# EAGLE design SHIFT_REG_LED_CONTROLLER copy (EAGLE 9.6.2)
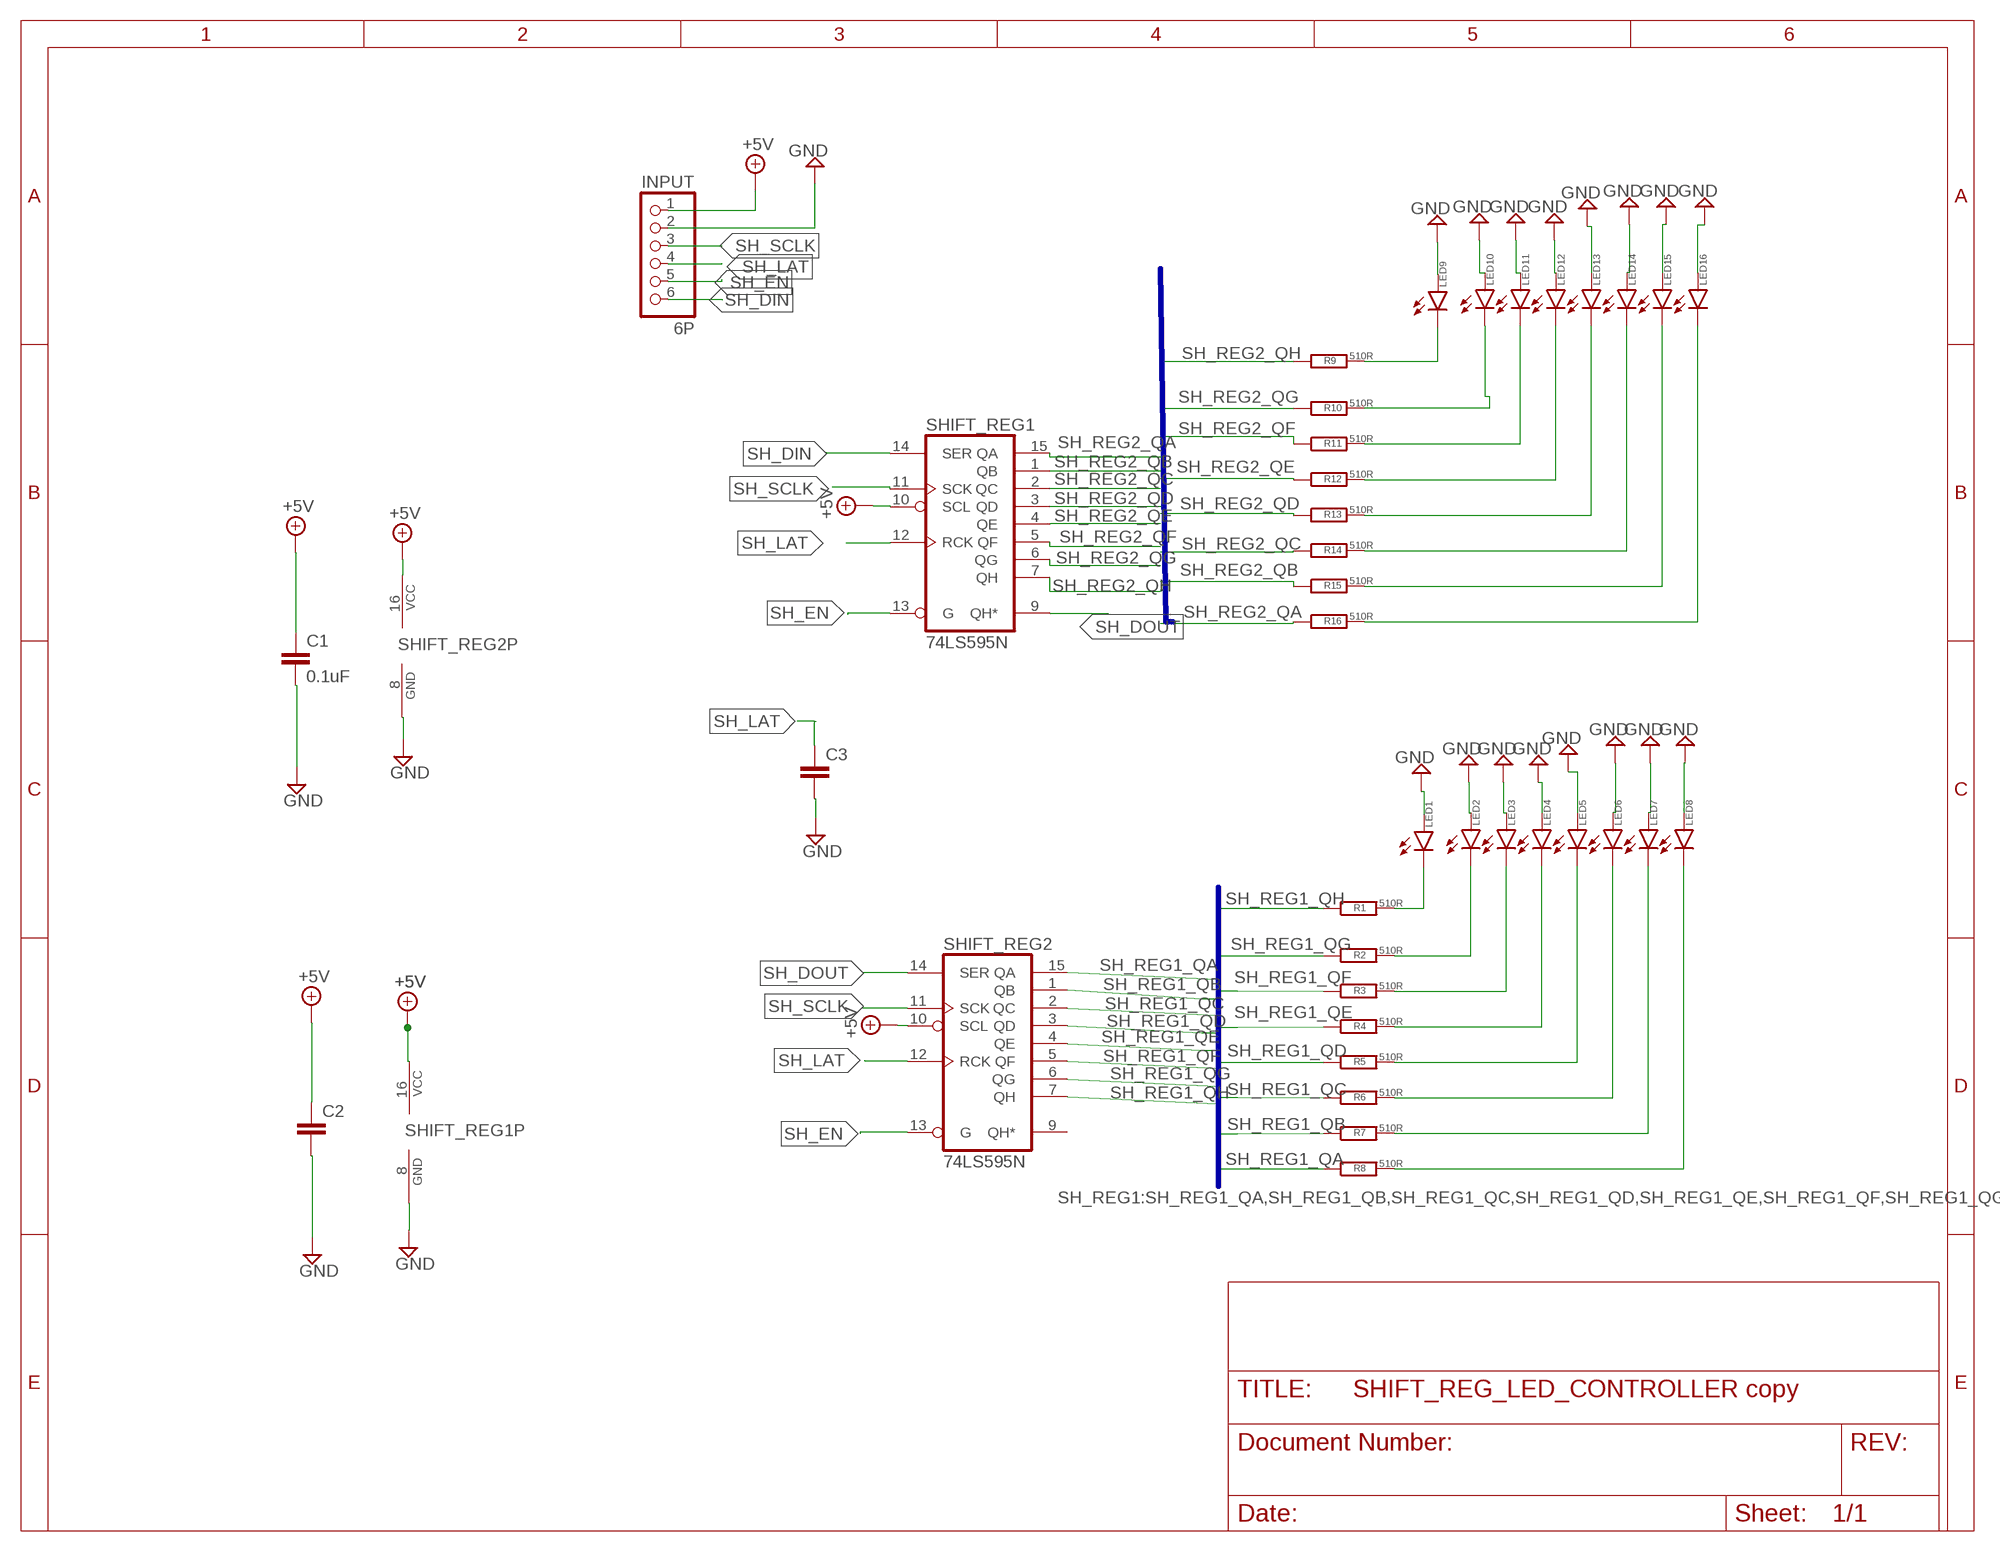
[diagram p0: schematic, sheet 1]

## Parts
C1  0.1uF  C-EU050-030X075  [C050-030X075]
C2  C-EU050-030X075  [C050-030X075]
C3  C-EU050-030X075  [C050-030X075]
INPUT  6P  PINHD-1X6  [1X06]
LED1  LED5MM  [LED5MM]
LED2  LED5MM  [LED5MM]
LED3  LED5MM  [LED5MM]
LED4  LED5MM  [LED5MM]
LED5  LED5MM  [LED5MM]
LED6  LED5MM  [LED5MM]
LED7  LED5MM  [LED5MM]
LED8  LED5MM  [LED5MM]
LED9  LED5MM  [LED5MM]
LED10  LED5MM  [LED5MM]
LED11  LED5MM  [LED5MM]
LED12  LED5MM  [LED5MM]
LED13  LED5MM  [LED5MM]
LED14  LED5MM  [LED5MM]
LED15  LED5MM  [LED5MM]
LED16  LED5MM  [LED5MM]
R1  510R  R-EU_0207/10  [0207/10]
R2  510R  R-EU_0207/10  [0207/10]
R3  510R  R-EU_0207/10  [0207/10]
R4  510R  R-EU_0207/10  [0207/10]
R5  510R  R-EU_0207/10  [0207/10]
R6  510R  R-EU_0207/10  [0207/10]
R7  510R  R-EU_0207/10  [0207/10]
R8  510R  R-EU_0207/10  [0207/10]
R9  510R  R-EU_0207/10  [0207/10]
R10  510R  R-EU_0207/10  [0207/10]
R11  510R  R-EU_0207/10  [0207/10]
R12  510R  R-EU_0207/10  [0207/10]
R13  510R  R-EU_0207/10  [0207/10]
R14  510R  R-EU_0207/10  [0207/10]
R15  510R  R-EU_0207/10  [0207/10]
R16  510R  R-EU_0207/10  [0207/10]
SHIFT_REG1  74LS595N  [DIL16]
SHIFT_REG2  74LS595N  [DIL16]

## Nets
+5V: C1.1 C2.1 INPUT.1 SHIFT_REG1.10(SCL) SHIFT_REG1.16(VCC) SHIFT_REG2.10(SCL) SHIFT_REG2.16(VCC)
GND: C1.2 C2.2 C3.2 INPUT.2 LED1.A LED2.A LED3.A LED4.A LED5.A LED6.A LED7.A LED8.A LED9.A LED10.A LED11.A LED12.A LED13.A LED14.A LED15.A LED16.A SHIFT_REG1.8(GND) SHIFT_REG2.8(GND)
N$1: LED1.K(C) R1.2
N$2: LED2.K(C) R2.2
N$3: LED3.K(C) R3.2
N$4: LED4.K(C) R4.2
N$5: LED5.K(C) R5.2
N$6: LED6.K(C) R6.2
N$7: LED7.K(C) R7.2
N$8: LED8.K(C) R8.2
N$9: LED9.K(C) R9.2
N$10: LED10.K(C) R10.2
N$11: LED11.K(C) R11.2
N$12: LED12.K(C) R12.2
N$13: LED13.K(C) R13.2
N$14: LED14.K(C) R14.2
N$15: LED15.K(C) R15.2
N$16: LED16.K(C) R16.2
SH_DIN: INPUT.6 SHIFT_REG1.14(SER)
SH_DOUT: SHIFT_REG1.9(QH*) SHIFT_REG2.14(SER)
SH_EN: INPUT.5 SHIFT_REG1.13(G) SHIFT_REG2.13(G)
SH_LAT: C3.1 INPUT.4 SHIFT_REG1.12(RCK) SHIFT_REG2.12(RCK)
SH_REG1_QA: R8.1 SHIFT_REG2.15(QA)
SH_REG1_QB: R7.1 SHIFT_REG2.1(QB)
SH_REG1_QC: R6.1 SHIFT_REG2.2(QC)
SH_REG1_QD: R5.1 SHIFT_REG2.3(QD)
SH_REG1_QE: R4.1 SHIFT_REG2.4(QE)
SH_REG1_QF: R3.1 SHIFT_REG2.5(QF)
SH_REG1_QG: R2.1 SHIFT_REG2.6(QG)
SH_REG1_QH: R1.1 SHIFT_REG2.7(QH)
SH_REG2_QA: R16.1 SHIFT_REG1.15(QA)
SH_REG2_QB: R15.1 SHIFT_REG1.1(QB)
SH_REG2_QC: R14.1 SHIFT_REG1.2(QC)
SH_REG2_QD: R13.1 SHIFT_REG1.3(QD)
SH_REG2_QE: R12.1 SHIFT_REG1.4(QE)
SH_REG2_QF: R11.1 SHIFT_REG1.5(QF)
SH_REG2_QG: R10.1 SHIFT_REG1.6(QG)
SH_REG2_QH: R9.1 SHIFT_REG1.7(QH)
SH_SCLK: INPUT.3 SHIFT_REG1.11(SCK) SHIFT_REG2.11(SCK)
Unconnected: SHIFT_REG2.9(QH*)

## Buses
SH_REG1:SH_REG1_QA,SH_REG1_QB,SH_REG1_QC,SH_REG1_QD,SH_REG1_QE,SH_REG1_QF,SH_REG1_QG,SH_REG1_QH
SH_REG2:SH_REG2_QA,SH_REG2_QB,SH_REG2_QC,SH_REG2_QD,SH_REG2_QE,SH_REG2_QF,SH_REG2_QG,SH_REG2_QH

## Library data of the parts
C1-C3 = rcl:C-EU: CAPACITOR, European symbol; SPICEPREFIX: C
INPUT = pinhead:PINHD-1X6: PIN HEADER
LED1-LED16 = led:LED: LED OSRAM: - CHIPLED LG R971, LG N971, LY N971, LG Q971, LY Q971, LO R971, LY R971 LH N974, LH R974 LS Q976, LO Q976, LY Q976 LO Q996 - Hyper CHIPLED LW Q18S LB Q993, LB Q99A, LB R99A - SideLED LS A670, LO A670, LY A670, LG A670, LP A670 LB A673, LV A673, LT A673, LW A673 LH A674 LY A675 LS A676, LA A676, LO A676, LY A676, LW A676 LS A679, LY A679, LG A679 - Hyper Micro SIDELED® LS Y876, LA Y876, LO Y876, LY Y876 LT Y87S - SmartLED LW L88C, LW L88S LB L89C, LB L89S, LG L890 LS L89K, LO L89K, LY L89K LS L896, LA L896, LO L896, LY L896 - TOPLED LS T670, LO T670, LY T670, LG T670, LP T670 LSG T670, LSP T670, LSY T670, LOP T670, LYG T670 LG T671, LOG T671, LSG T671 LB T673, LV T673, LT T673, LW T673 LH T674 LS T676, LA T676, LO T676, LY T676, LB T676, LH T676, LSB T676, LW T676 LB T67C, LV T67C, LT T67C, LS T67K, LO T67K, LY T67K, LW E67C LS E67B, LA E67B, LO E67B, LY E67B, LB E67C, LV E67C, LT E67C LW T67C LS T679, LY T679, LG T679 LS T770, LO T770, LY T770, LG T770, LP T770 LB T773, LV T773, LT T773, LW T773 LH T774 LS E675, LA E675, LY E675, LS T675 LS T776, LA T776, LO T776, LY T776, LB T776 LHGB T686 LT T68C, LB T68C - Hyper Mini TOPLED® LB M676 - Mini TOPLED Santana® LG M470 LS M47K, LO M47K, LY M47K Source: http://www.osram.convergy.de LUXEON: - LUMILED® LXK2-PW12-R00, LXK2-PW12-S00, LXK2-PW14-U00, LXK2-PW14-V00 LXK2-PM12-R00, LXK2-PM12-S00, LXK2-PM14-U00 LXK2-PE12-Q00, LXK2-PE12-R00, LXK2-PE12-S00, LXK2-PE14-T00, LXK2-PE14-U00 LXK2-PB12-K00, LXK2-PB12-L00, LXK2-PB12-M00, LXK2-PB14-N00, LXK2-PB14-P00, LXK2-PB14-Q00 LXK2-PR12-L00, LXK2-PR12-M00, LXK2-PR14-Q00, LXK2-PR14-R00 LXK2-PD12-Q00, LXK2-PD12-R00, LXK2-PD12-S00 LXK2-PH12-R00, LXK2-PH12-S00 LXK2-PL12-P00, LXK2-PL12-Q00, LXK2-PL12-R00 Source: www.luxeon.com KINGBRIGHT: KA-3528ASYC Source: www.kingbright.com
R1-R16 = rcl:R-EU_: RESISTOR, European symbol; SPICEPREFIX: R
SHIFT_REG1 SHIFT_REG2 = 74xx-us:74*595: 8-bit SHIFT REGISTER, output latch

## Board
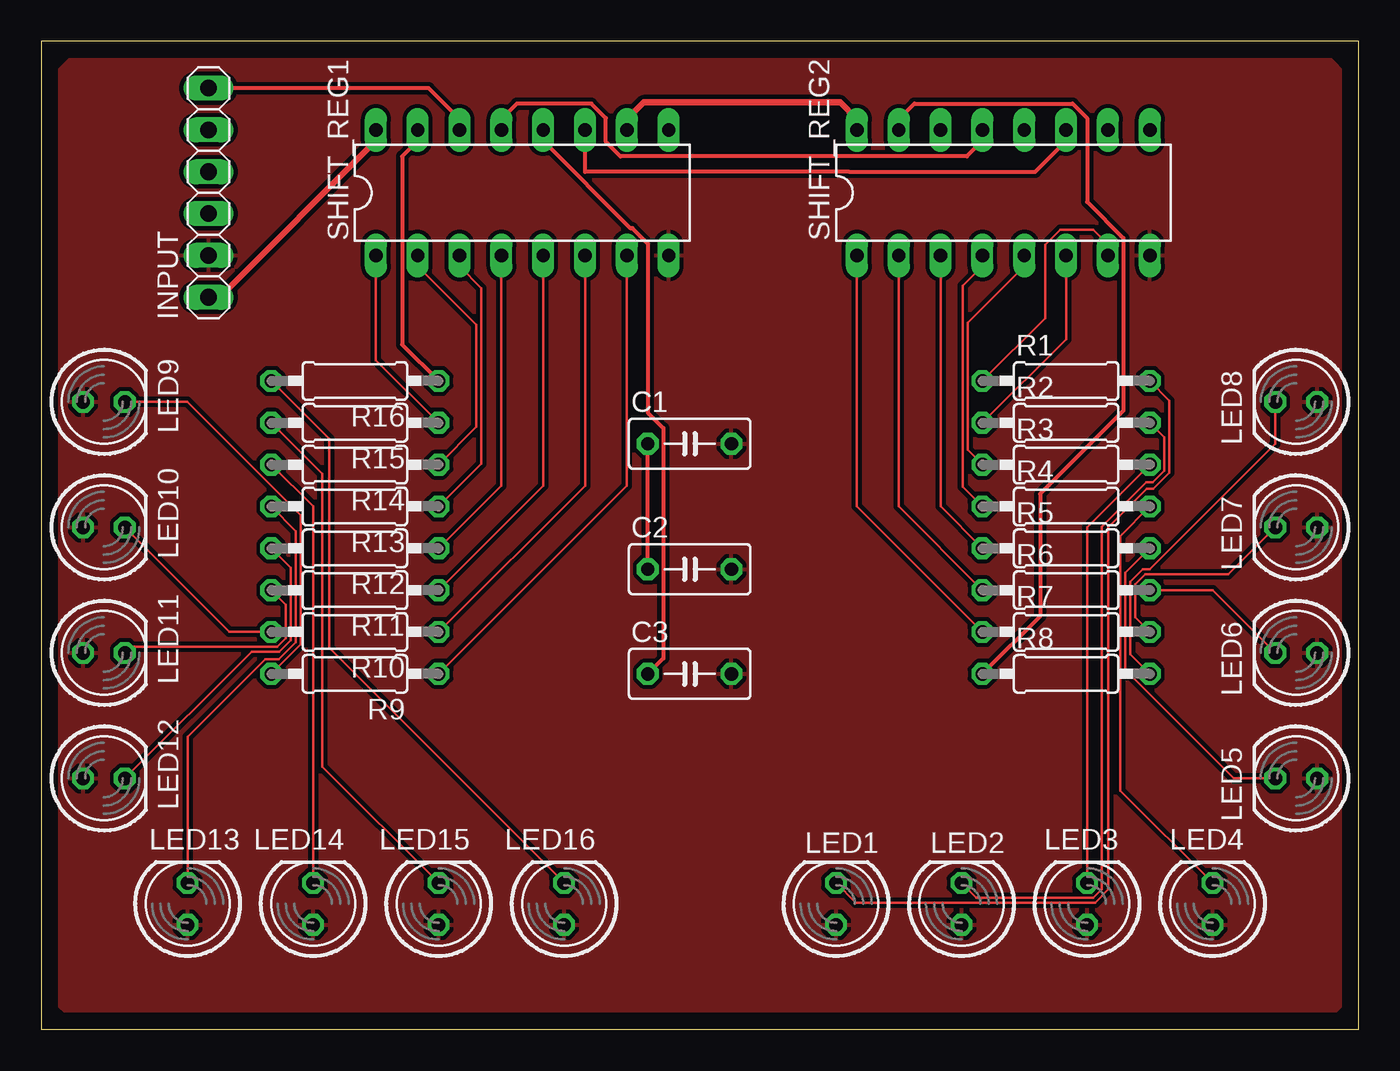
[diagram p1: board, top side]
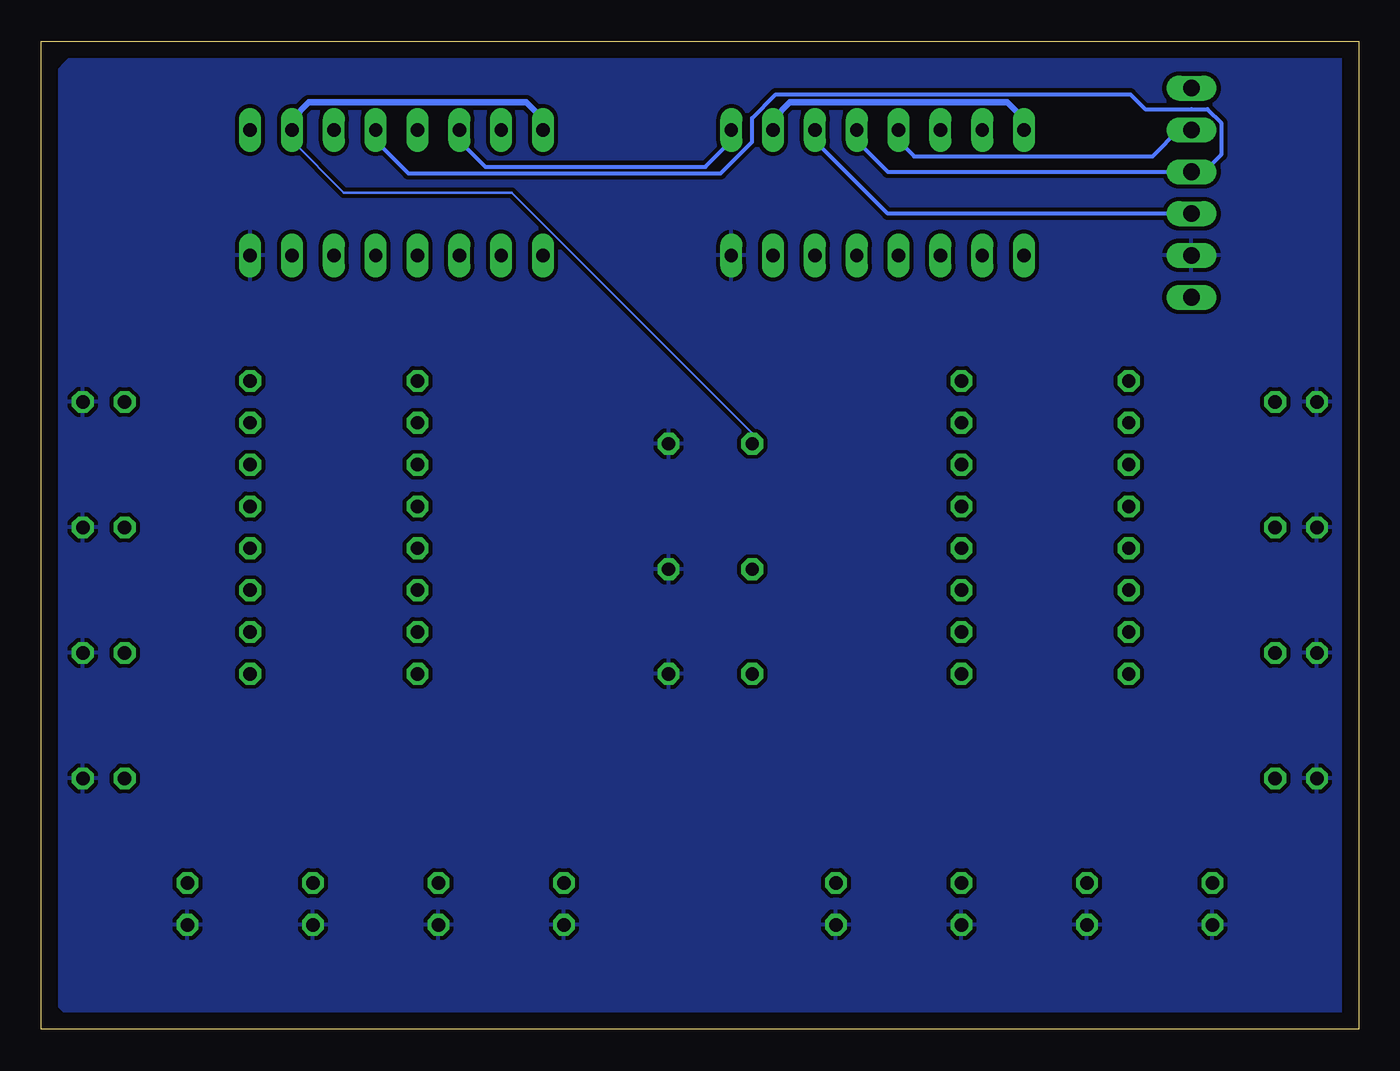
[diagram p2: board, bottom side, seen from below]

Size 80 x 60 mm. Coordinates in mm from the lower left corner, seen from the top.
Outline: 0,0 80,0 80,60 0,60 0,0
Copper layers (1*16): Top 0.035mm / dielectric 0.15mm / Bottom 0.035mm
Design rules "default": minimum track width 6mil, minimum drill 0.35mm, track to track 6mil, track to pad 6mil, pad to pad 6mil, via to via 6mil, smd to smd 6mil, copper to edge 40mil, drill to drill 6mil, minimum pad ring 10mil, minimum via ring 8mil, stop-mask expansion 4mil, vias tented up to drill 0mil, thermal gap 10mil

### Footprints (pad centres in the part's own frame; a part is rotated, then mirrored left to right if it is on the bottom)
C050-030X075 = drill 0.813 octagon: 1 -2.54,0; 2 2.54,0
1X06 = drill 1.016 long: 1 -6.35,0; 2 -3.81,0; 3 -1.27,0; 4 1.27,0; 5 3.81,0; 6 6.35,0
LED5MM = drill 0.813 octagon: A -1.27,0; K 1.27,0
0207/10 = drill 0.813 octagon: 1 -5.08,0; 2 5.08,0
DIL16 = drill 0.813 long: 1 -8.89,-3.81; 2 -6.35,-3.81; 3 -3.81,-3.81; 4 -1.27,-3.81; 5 1.27,-3.81; 6 3.81,-3.81; 7 6.35,-3.81; 8 8.89,-3.81; 9 8.89,3.81; 10 6.35,3.81; 11 3.81,3.81; 12 1.27,3.81; 13 -1.27,3.81; 14 -3.81,3.81; 15 -6.35,3.81; 16 -8.89,3.81

### Placement (x,y rotation side)
C1  39.37,35.56 0 top
C2  39.37,27.94 0 top
C3  39.37,21.59 0 top
INPUT  10.16,50.8 90 top
LED1  48.26,7.62 90 top
LED2  55.88,7.62 90 top
LED3  63.5,7.62 90 top
LED4  71.12,7.62 90 top
LED5  76.2,15.24 180 top
LED6  76.2,22.86 180 top
LED7  76.2,30.48 180 top
LED8  76.2,38.1 180 top
LED9  3.81,38.1 0 top
LED10  3.81,30.48 0 top
LED11  3.81,22.86 0 top
LED12  3.81,15.24 0 top
LED13  8.89,7.62 90 top
LED14  16.51,7.62 90 top
LED15  24.13,7.62 90 top
LED16  31.75,7.62 90 top
R1  62.23,39.37 0 top
R2  62.23,36.83 0 top
R3  62.23,34.29 0 top
R4  62.23,31.75 0 top
R5  62.23,29.21 0 top
R6  62.23,26.67 0 top
R7  62.23,24.13 0 top
R8  62.23,21.59 0 top
R9  19.05,21.59 180 top
R10  19.05,24.13 180 top
R11  19.05,26.67 180 top
R12  19.05,29.21 180 top
R13  19.05,31.75 180 top
R14  19.05,34.29 180 top
R15  19.05,36.83 180 top
R16  19.05,39.37 180 top
SHIFT_REG1  29.21,50.8 0 top
SHIFT_REG2  58.42,50.8 0 top

### Tracks (layer width: path | path; a pad name or v marks a point on that pad's centre or on a via)
+5V
  Top 0.254: C2.1 C1.1
  Top 0.4: SHIFT_REG1.16 20.32,53.95 10.92,44.55 10.92,44.45 INPUT.1 | SHIFT_REG2.16 49.53,55.27 48.52,56.28 36.57,56.28 35.56,55.27 SHIFT_REG1.10
  Bottom 0.152: SHIFT_REG2.10 64.77,53.95 61.62,50.8 51.42,50.8 36.83,36.21 C1.1
  Bottom 0.4: SHIFT_REG1.10 35.56,55.27 34.55,56.28 21.33,56.28 20.32,55.27 SHIFT_REG1.16 | SHIFT_REG2.10 64.77,55.27 63.76,56.28 50.54,56.28 49.53,55.27 SHIFT_REG2.16
GND
  pour Top (isolate 0.25): 77.47,59.69 2.54,59.69 0,57.15 0,2.54 2.54,0 77.47,0 80.01,2.54 80.01,57.15
  pour Bottom (isolate 0.25): 1.27,59.69 77.47,59.69 80.01,57.15 80.01,2.54 77.47,0 1.27,0 0,1.27 0,58.42
N$1
  Top 0.152: R1.2 68.5,38.18 68.5,33.8 67.53,32.82 67.12,32.82 64.8,30.5 64.8,8.5 63.99,7.7 49.45,7.7 LED1.K
N$2
  Top 0.152: R2.2 68.2,35.94 68.2,33.92 67.5,33.22 67.09,33.22 64.39,30.52 64.39,8.52 63.87,8 56.77,8 LED2.K
N$3
  Top 0.152: R3.2 63.5,30.48 LED3.K
N$4
  Top 0.152: LED4.K 65.51,14.5 65.51,29.95 R4.2
N$5
  Top 0.152: LED5.K 72.4,15.24 65.81,21.83 65.81,27.71 R5.2
N$6
  Top 0.152: R6.2 71.12,26.67 LED6.K
N$7
  Top 0.152: R7.2 66.42,25.02 66.42,27.04 67.02,27.64 72.08,27.64 LED7.K
N$8
  Top 0.152: LED8.K 74.93,35.57 67.3,27.94 66.89,27.94 66.12,27.16 66.12,22.78 R8.2
N$9
  Top 0.152: LED9.K 8.88,38.1 15.77,31.2 15.77,23.38 R9.2
N$10
  Top 0.152: R10.2 11.43,24.13 LED10.K
N$11
  Top 0.152: R11.2 14.86,25.78 14.86,23.76 14.34,23.24 5.46,23.24 LED11.K
N$12
  Top 0.152: LED12.K 12.78,22.94 14.46,22.94 15.16,23.64 15.16,28.02 R12.2
N$13
  Top 0.152: R13.2 15.47,30.25 15.47,23.51 14.44,22.48 13.6,22.48 8.89,17.77 LED13.K
N$14
  Top 0.152: R14.2 16.51,31.75 LED14.K
N$15
  Top 0.152: R15.2 17.07,33.73 17.07,15.95 LED15.K
N$16
  Top 0.152: LED16.K 17.48,23.16 17.48,35.87 R16.2
SH_DIN
  Top 0.254: SHIFT_REG1.14 25.4,55.27 23.52,57.15 10.92,57.15 INPUT.6
SH_DOUT
  Bottom 0.254: SHIFT_REG2.14 54.61,53.95 53.03,52.38 39.67,52.38 38.1,53.95 SHIFT_REG1.9
SH_EN
  Top 0.254: SHIFT_REG2.13 57.15,53.95 56.21,53.01 35.17,53.01 34.29,53.89 34.29,55.33 33.41,56.21 28.88,56.21 27.94,55.27 SHIFT_REG1.13
  Bottom 0.254: SHIFT_REG1.13 27.94,53.95 27,53.01 12.52,53.01 10.92,54.61 INPUT.5
SH_LAT
  Top 0.254: SHIFT_REG1.12 30.48,53.95 35.78,48.65 35.89,48.65 36.83,47.71 36.83,37.44 37.77,36.5 37.77,22.53 C3.1
  Bottom 0.254: 30.48,53.95 SHIFT_REG1.12 30.48,53.95 | 30.48,53.95 28.6,52.07 10.92,52.07 INPUT.4 9.4,52.07 8.36,53.11 8.36,55.04 9.2,55.88 10.16,55.88 12.98,55.88 13.86,56.76 35.4,56.76 36.83,55.33 36.83,53.89 38.75,51.97 57.71,51.97 59.69,53.95 SHIFT_REG2.12
SH_REG1_QA
  Top 0.254: SHIFT_REG2.15 52.07,55.27 53.01,56.21 62.62,56.21 63.5,55.33 63.5,50.25 65.71,48.04 65.71,37.58 60.66,32.52 60.66,25.09 R8.1
SH_REG1_QB
  Top 0.152: SHIFT_REG2.1 49.53,31.75 R7.1
SH_REG1_QC
  Top 0.152: SHIFT_REG2.2 52.07,31.75 R6.1
SH_REG1_QD
  Top 0.152: SHIFT_REG2.3 54.61,31.75 R5.1
SH_REG1_QE
  Top 0.152: SHIFT_REG2.4 57.15,46.33 55.96,45.14 55.96,32.94 R4.1
SH_REG1_QF
  Top 0.152: SHIFT_REG2.5 59.69,46.33 56.26,42.9 56.26,35.18 R3.1
SH_REG1_QG
  Top 0.152: SHIFT_REG2.6 62.23,41.91 R2.1
SH_REG1_QH
  Top 0.152: SHIFT_REG2.7 64.77,47.65 63.88,48.54 61.86,48.54 60.96,47.64 60.96,43.18 R1.1
SH_REG2_QA
  Top 0.254: SHIFT_REG1.15 22.86,53.95 21.92,53.01 21.92,41.58 R16.1
SH_REG2_QB
  Top 0.152: R15.1 20.32,40.64 SHIFT_REG1.1
SH_REG2_QC
  Top 0.152: R14.1 26.42,36.58 26.42,42.77 22.86,46.33 SHIFT_REG1.2
SH_REG2_QD
  Top 0.152: SHIFT_REG1.3 25.4,46.33 26.72,45.01 26.72,34.34 R13.1
SH_REG2_QE
  Top 0.152: SHIFT_REG1.4 27.94,33.02 R12.1
SH_REG2_QF
  Top 0.152: R11.1 30.48,33.02 SHIFT_REG1.5
SH_REG2_QG
  Top 0.152: R10.1 33.02,33.02 SHIFT_REG1.6
SH_REG2_QH
  Top 0.152: SHIFT_REG1.7 35.56,33.02 R9.1
SH_SCLK
  Top 0.254: SHIFT_REG1.11 33.02,53.95 33.02,52.07 49.07,52.07 60.35,52.07 62.23,53.95 SHIFT_REG2.11
  Bottom 0.254: INPUT.3 10.92,49.53 28.6,49.53 33.02,53.95 SHIFT_REG1.11